# Altium schematic sheet sem4200.SchDoc
size A3
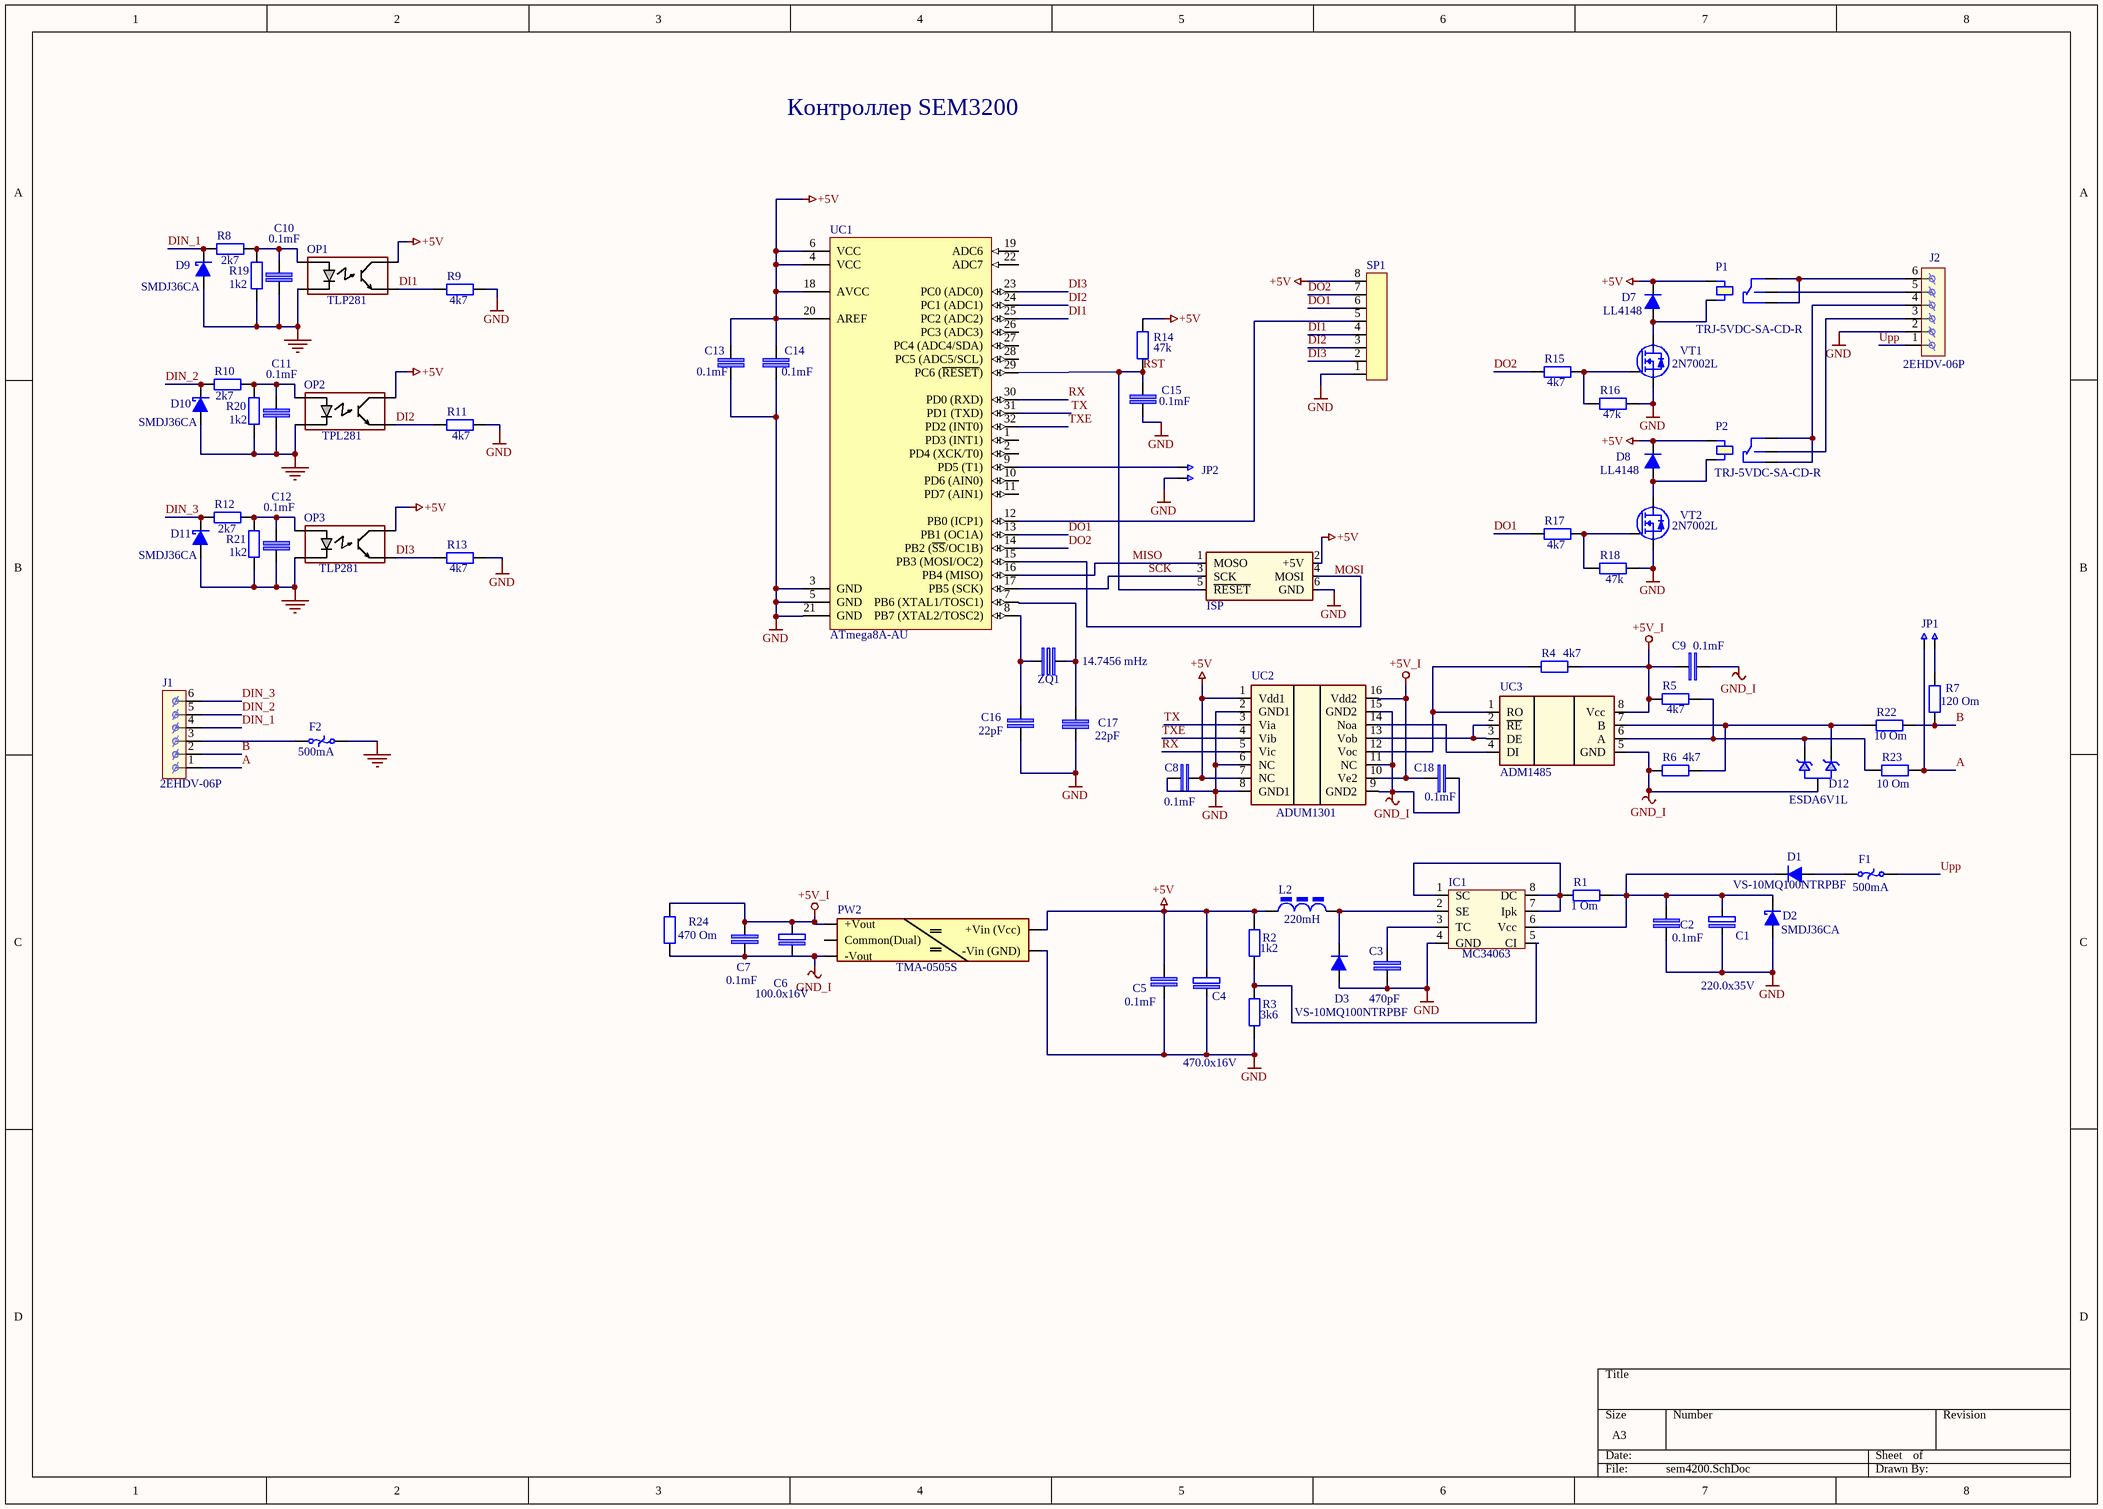
[diagram p0: sem4200.SchDoc]

## Parts
C1  220.0x35V  [Cap_2(10x12.5)]
C2  value 0.1mF  [CAPC2113X13N_0805]  (hidden comment: 0.1)
C3  value 470pF  [CAPC2113X13N_0805]  (hidden comment: 470 pF)
C4  value 470.0x16V  [Cap_2(10x12.5)]  (hidden comment: 470.0x35V)
C5  value 0.1mF  [CAPC2113X13N_0805]  (hidden comment: 0.1)
C6  value 100.0x16V  [Cap_4(5x10)]  (hidden comment: 22.0x16V)
C7  value 0.1mF  [CAPC2113X13N_0805]  (hidden comment: 0.1)
C8  value 0.1mF  [CAPC2113X13N_0805]  (hidden comment: 0.1)
C9  value 0.1mF  [CAPC2113X13N_0805]  (hidden comment: 0.1)
C10  value 0.1mF  [CAPC2113X13N_0805]  (hidden comment: 0.1)
C11  value 0.1mF  [CAPC2113X13N_0805]  (hidden comment: 0.1)
C12  value 0.1mF  [CAPC2113X13N_0805]  (hidden comment: 0.1)
C13  value 0.1mF  [CAPC2113X13N_0805]  (hidden comment: 0.1)
C14  value 0.1mF  [CAPC2113X13N_0805]  (hidden comment: 0.1)
C15  value 0.1mF  [CAPC2113X13N_0805]  (hidden comment: 0.1)
C16  value 22pF  [CAPC2113X13N_0805]  (hidden comment: 20p)
C17  value 22pF  [CAPC2113X13N_0805]  (hidden comment: 20p)
C18  value 0.1mF  [CAPC2113X13N_0805]  (hidden comment: 0.1)
D1  Type: VS-10MQ100NTRPBF  [DIOD_SMA]  (hidden comment: SS18)
D2  SMDJ36CA  [SMB_1]
D3  Type: VS-10MQ100NTRPBF  [DIOD_SMA]  (hidden comment: SS18)
D7  LL4148  [DIOD_MELF_SOD80]
D8  LL4148  [DIOD_MELF_SOD80]
D9  SMDJ36CA  [SMB_1]
D10  SMDJ36CA  [SMB_1]
D11  SMDJ36CA  [SMB_1]
D12  ESDA6V1L  [SOT23_diod_ESDA]
F1  500mA  [Fuse_termo]
F2  500mA  [Fuse_termo]
IC1  MC34063  [SOIC_SO-8]
ISP  ISP  [ISP_1]  (value not drawn)
J1  Type: 2EHDV-06P  [conn6X1]  (hidden comment: Conn_6x1)
J2  Type: 2EHDV-06P  [conn6X1]  (hidden comment: Conn_6x1)
JP1  jamper  [JP_2_2.5]  (value not drawn)
JP2  jamper  [JP_2_2.5]  (value not drawn)
L2  220mH  [Dr_1]
OP1  Type: TLP281  [SOIC127_TPL]  (hidden comment: TLP281GB)
OP2  Type: TPL281  [SOIC127_TPL]  (hidden comment: TLP281GB)
OP3  Type: TLP281  [SOIC127_TPL]  (hidden comment: TLP281GB)
P1  Type: TRJ-5VDC-SA-CD-R  [PCB_rele_TRJ]  (hidden comment: TRJ)
P2  Type: TRJ-5VDC-SA-CD-R  [PCB_rele_TRJ]  (hidden comment: TRJ)
PW2  Type: TMA-0505S  [TMA_1W]  (hidden comment: TMA_0505)
R1  1 Om  [RES_1206]
R2  1k2  [RESC2113X0805N]
R3  3k6  [RESC2113X0805N]
R4  value 4k7  [RESC2113X0805N]  (hidden comment: 10k)
R5  4k7  [RESC2113X0805N]
R6  4k7  [RESC2113X0805N]
R7  120 Om  [RES_1206]
R8  2k7  [Chip2Pin_2010]
R9  4k7  [RESC2113X0805N]
R10  2k7  [Chip2Pin_2010]
R11  value 4k7  [RESC2113X0805N]  (hidden comment: 47k)
R12  2k7  [Chip2Pin_2010]
R13  value 4k7  [RESC2113X0805N]  (hidden comment: 47k)
R14  47k  [RESC2113X0805N]
R15  4k7  [RESC2113X0805N]
R16  47k  [RESC2113X0805N]
R17  4k7  [RESC2113X0805N]
R18  47k  [RESC2113X0805N]
R19  1k2  [RESC2113X0805N]
R20  1k2  [RESC2113X0805N]
R21  1k2  [RESC2113X0805N]
R22  10 Om  [RESC2113X0805N]
R23  10 Om  [RESC2113X0805N]
R24  470 Om  [RES_1206]
SP1  SP1  [Conn8x1]  (value not drawn)
UC1  ATmega8A-AU  [32A_N]
UC2  ADUM1301  [SOIC127P1030X265-16N_SOIC_W]
UC3  ADM1485  [SOIC127P600X175-8N_SOIC_SO8]
VT1  2N7002L  [SOT_23]
VT2  2N7002L  [SOT_23]
ZQ1  value 14.7456 mHz  [ZQ_1]  (hidden comment: 7.3728)

## Nets
+5V: C4.1 C5.1 C8.1 C13.1 C14.1 D7.2 D8.2 ISP.2(+5V) L2.2 OP1.4 OP2.4 OP3.4 P1.1 P2.1 PW2.1(+Vin_(Vcc)) R2.2 R14.2 SP1.8 UC1.4(VCC) UC1.6(VCC) UC1.18(AVCC) UC1.20(AREF) UC2.1(Vdd1) UC2.7(NC)
+5V_I: C6.1 C7.1 C9.2 C18.1 PW2.5(+Vout) R4.1 R5.2 R24.1 UC2.10(Ve2) UC2.16(Vdd2) UC3.8(Vcc)
E_GND: C10.2 C11.2 C12.2 D9.2 D10.2 D11.2 F2.2 OP1.2 OP2.2 OP3.2 R19.1 R20.1 R21.1
GND: C1.2 C2.2 C3.2 C4.2 C5.2 C8.2 C13.2 C14.2 C15.2 C16.2 C17.2 D2.2 D3.1 IC1.4(GND) ISP.6(GND) J2.2 JP2.2 PW2.2(-Vin_(GND)) R3.1 R9.2 R11.2 R13.2 R16.1 R18.1 SP1.1 UC1.3(GND) UC1.5(GND) UC1.21(GND) UC2.2(GND1) UC2.6(NC) UC2.8(GND1) VT1.2 VT2.2
GND_I: C6.2 C7.2 C9.1 C18.2 D12.3 PW2.3(-Vout) R6.2 R24.2 UC2.9(GND2) UC2.11(NC) UC2.15(GND2) UC3.5(GND)
A: J1.1 JP1.1 R23.1
B: J1.2 R7.1 R22.1
DI1: OP1.3 R9.1 SP1.4 UC1.25(PC2_(ADC2))
DI2: OP2.3 R11.1 SP1.3 UC1.24(PC1_(ADC1))
DI3: OP3.3 R13.1 SP1.2 UC1.23(PC0_(ADC0))
DIN_1: D9.1 J1.4 R8.1
DIN_2: D10.1 J1.5 R10.1
DIN_3: D11.1 J1.6 R12.1
DO1: R17.2 SP1.6 UC1.13(PB1_(OC1A))
DO2: R15.2 SP1.7 UC1.14(PB2_(~{SS}/OC1B))
MISO: ISP.1(MOSO) UC1.16(PB4_(MISO))
RST: C15.1 ISP.5(~{RESET}) R14.1 UC1.29(PC6_(~{RESET}))
RX: UC1.30(PD0_(RXD)) UC2.5(Vic)
SCK: ISP.3(SCK) UC1.17(PB5_(SCK))
TX: UC1.31(PD1_(TXD)) UC2.3(Via)
TXE: UC1.32(PD2_(INT0)) UC2.4(Vib)
Upp: F1.2 J2.1
NetC1_1: C1.1 C2.1 D1.2 D2.1 IC1.6(Vcc) R1.2
NetC3_1: C3.1 IC1.3(TC)
NetC10_1: C10.1 OP1.1 R8.2 R19.2
NetC11_1: C11.1 OP2.1 R10.2 R20.2
NetC12_1: C12.1 OP3.1 R12.2 R21.2
NetC16_1: C16.1 UC1.8(PB7_(XTAL2/TOSC2)) ZQ1.1
NetC17_1: C17.1 UC1.7(PB6_(XTAL1/TOSC1)) ZQ1.2
NetD1_1: D1.1 F1.1
NetD3_2: D3.2 IC1.2(SE) L2.1
NetD7_1: D7.1 P1.5 VT1.3
NetD8_1: D8.1 P2.5 VT2.3
NetD12_1: D12.1 R6.1 R22.2 UC3.7(B)
NetD12_2: D12.2 R5.1 R23.2 UC3.6(A)
NetF2_1: F2.1 J1.3
NetIC1_1: IC1.1(SC) IC1.7(Ipk) IC1.8(DC) R1.1
NetIC1_5: IC1.5(CI) R2.1 R3.2
NetISP_4: ISP.4(MOSI) UC1.15(PB3_(MOSI/OC2))
NetJ2_3: J2.3 P2.3
NetJ2_4: J2.4 P2.2 P2.4
NetJ2_5: J2.5 P1.3
NetJ2_6: J2.6 P1.2 P1.4
NetJP1_2: JP1.2 R7.2
NetJP2_1: JP2.1 UC1.9(PD5_(T1))
NetR4_2: R4.2 UC2.12(Voc) UC3.1(RO)
NetR15_1: R15.1 R16.2 VT1.1
NetR17_1: R17.1 R18.2 VT2.1
NetSP1_5: SP1.5 UC1.12(PB0_(ICP1))
NetUC2_13: UC2.13(Vob) UC3.2(~{RE}) UC3.3(DE)
NetUC2_14: UC2.14(Noa) UC3.4(DI)

Not connected (* = marked no-connect by the designer): PW2 4(Common(Dual)); UC1 1(PD3_(INT1)) 2(PD4_(XCK/T0)) 10(PD6_(AIN0)) 11(PD7_(AIN1)) 19(ADC6) 22(ADC7) 26(PC3_(ADC3)) 27(PC4_(ADC4/SDA)) 28(PC5_(ADC5/SCL))

## Notes on the sheet
- Контроллер SEM3200
- Labels drawn without touching a wire or pin: MOSI

## Library data of the parts
C1 = Cap_pol2: Type: 10x12.5; Value: 220.0x35V
C2 C3 C5 C7-C18 = cap_1: Footprint: 0805
C4 C6 = Cap_pol2
  C4: Footprint: 10x12.5
  C6: Footprint: 5x10
D1 D3 = Diod_30BQ100: Footprint: SMA
D2 D9-D11 = Diodes_SMB: Type: SMDJ36CA; Footprint: SMB
D7 D8 = Diodes_4148: Type: LL4148; Footprint: SOD80
D12 = Diod_ESDA: Type: ESDA6V1L; Footprint: SOT23
F1 F2 = Fuse_term: Type: RXE050; Value: 500mA
IC1 = MC34063_1: Type: MC34063; Footprint: SO-8
ISP = ISP_1: Type: PLD-6 (DS1021-2x3S)
JP1 JP2 = JP_2x2.5: Type: PLS-2 (DS1021-1x2)
L2 = Dr_1: Type: RLB0712-221KL; Value: 220mH
OP1-OP3 = opto_TLP
P1 P2 = Rele_TRJ
PW2 = TRACO_PW1
R1-R24 = rez_1
  R1: Value: 1 Om; Footprint: 1206
  R2 R19-R21: Value: 1k2; Footprint: 0805
  R3: Value: 3k6; Footprint: 0805
  R4 R11 R13: Footprint: 0805
  R5 R6 R9 R15 R17: Value: 4k7; Footprint: 0805
  R7: Value: 120 Om; Footprint: 1206
  R8 R10 R12: Value: 2k7; Footprint: 2010
  R14 R16 R18: Value: 47k; Footprint: 0805
  R22 R23: Value: 10 Om; Footprint: 0805
  R24: Value: 470 Om; Footprint: 1206
SP1 = Conn8x1: Type: PLS-8 (DS1021-1x8)
UC1 = ATmega8A-AU: 8-bit AVR Microcontroller, 8KB Flash, 512 Bytes EEPROM, 1KB SRAM, 32-pin TQFP, Industrial Grade (-40°C to 85°C); Published: 1-Apr-2010; DatasheetVersion: revC, Jul-2009; PackageVersion: revB, Oct-2001; PackageReference: 32A; Publisher: Altium Limited; PackageDescription: 32-Lead, 7x7x1.0 mm Body, 0.8mm Lead Pitch, Thin Profile Plastic Quad Flat Package (TQFP); Supplier 1: Digi-Key; Supplier Part Number 1: ATMEGA8A-AU-ND; Supplier 2: Farnell; Supplier Part Number 2: 1748532; Supplier 3: Mouser; Supplier Part Number 3: 556-ATMEGA8A-AU; Code_JEDEC: MS-026-ABA; ComponentLink1Description: Manufacturer Link; ComponentLink1URL: http://www.atmel.com/products/avr/default.asp?; ComponentLink2Description: ATmega8A Datasheet; ComponentLink2URL: http://www.atmel.com/dyn/resources/prod_documents/doc8159.pdf; ComponentLink3Description: ATmega8A Summary; ComponentLink3URL: http://www.atmel.com/dyn/resources/prod_documents/8159S.pdf; ComponentLink4Description: Atmel.com Home; ComponentLink4URL: http://www.atmel.com; Footprint: TQFP-32
UC3 = ADM485
VT1 VT2 = n_chanel_tranzistor1: Type: 2N7002L
  VT1: footprint: SOT23
  VT2: Footprint: SOT23
ZQ1 = ZQ_1: Type: HC-49S
UC2 = ADUM1301: Type: ADUM1301; Footprint: SOIC_W